# Altium schematic sheet PowerAssembly.SchDoc: Board Power Assembly
size 292 x 193 mm; CheckedBy: Jakub Howorus; Author: Łukasz Gójski; CompanyName: Politechnika Warszawska; DrawnBy: Łukasz Gójski; Organization: EITI; Address1: Nowowiejska 15/19; Address2: 00-665 Warszawa; SheetNumber: 2; SheetTotal: 13; HTTPLink: www.pw.edu.pl
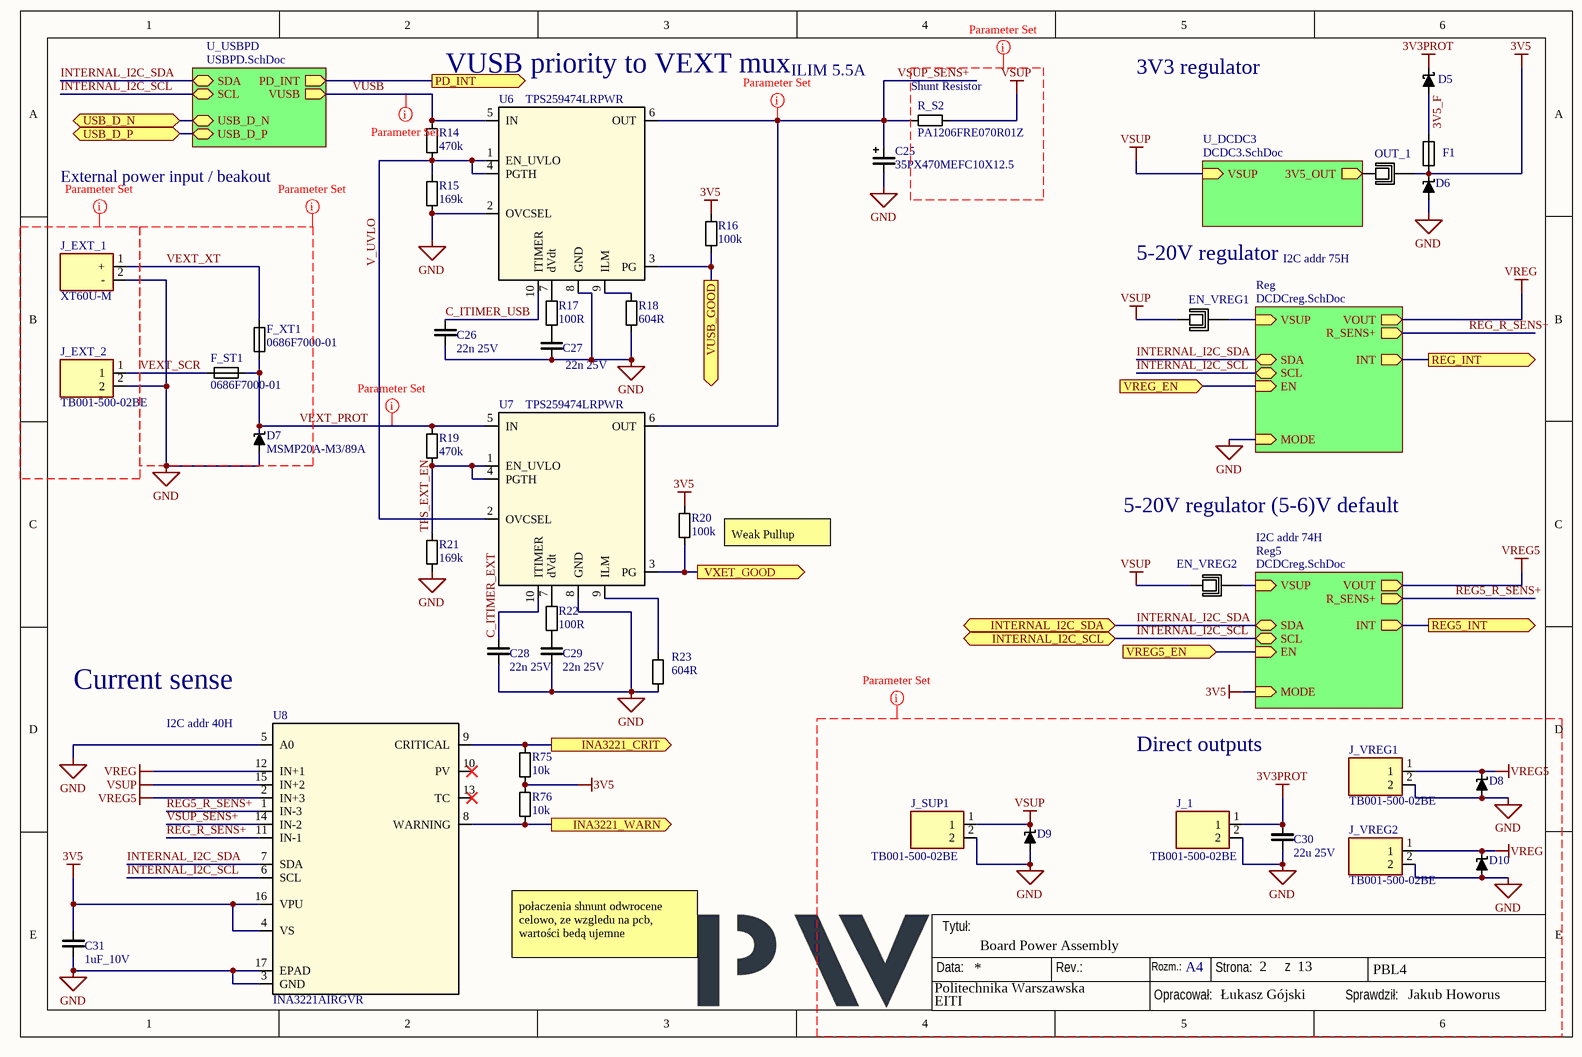
[diagram p0: PowerAssembly.SchDoc]

## Parts
C25  35PX470MEFC10X12.5  [CAP_PKPZ_10X12P5_LOW_RUB]
C26  22n 25V  [C_0603]
C27  22n 25V  [C_0603]
C28  22n 25V  [C_0603]
C29  22n 25V  [C_0603]
C30  22u 25V  [C_1206]
C31  1uF_10V  [C_0603]
D5  SL12-E3/61T  [DIONM5127X229N]  (value not drawn)
D6  MSMP20A-M3/89A  [CR_0A-M389A_VIS]  (value not drawn)
D7  MSMP20A-M3/89A  [CR_0A-M389A_VIS]
D8  MSMP20A-M3/89A  [CR_0A-M389A_VIS]  (value not drawn)
D9  MSMP20A-M3/89A  [CR_0A-M389A_VIS]  (value not drawn)
D10  MSMP20A-M3/89A  [CR_0A-M389A_VIS]  (value not drawn)
EN_VREG1  JUMPER  [Jumper]  (value not drawn)
EN_VREG2  JUMPER  [Jumper]  (value not drawn)
F1  SD110-08  [1812]  (value not drawn)
F_ST1  0686F7000-01  [0603_FUSE]
F_XT1  0686F7000-01  [0603_FUSE]
J_1  TB001-500-02BE  [TB00150002BE]
J_EXT_1  XT60U-M  [XT60U-M]
J_EXT_2  TB001-500-02BE  [TB00150002BE]
J_SUP1  TB001-500-02BE  [TB00150002BE]
J_VREG1  TB001-500-02BE  [TB00150002BE]
J_VREG2  TB001-500-02BE  [TB00150002BE]
OUT_1  JUMPER  [Jumper]  (value not drawn)
R14  470k  [R_0603]
R15  169k  [R_0603]
R16  100k  [R_0603]
R17  100R  [R_0603]
R18  604R  [R_0603]
R19  470k  [R_0603]
R20  100k  [R_0603]
R21  169k  [R_0603]
R22  100R  [R_0603]
R23  604R  [R_0603]
R75  10k  [R_0603]
R76  10k  [R_0603]
R_S2  PA1206FRE070R01Z  [R_1206]
U6  TPS259474LRPWR  [RPW0010A-MFG]
U7  TPS259474LRPWR  [RPW0010A-MFG]
U8  INA3221AIRGVR  [RGV16_2P16X2P16]

## Sub-sheets
Reg = DCDCreg.SchDoc: SDA (bidir), SCL (bidir), EN (in), VOUT (out), MODE (in), R_SENS+ (out), INT (out), VSUP (in)
Reg5 = DCDCreg.SchDoc: SDA (bidir), SCL (bidir), EN (in), VOUT (out), MODE (in), R_SENS+ (out), INT (out), VSUP (in)
U_DCDC3 = DCDC3.SchDoc: VSUP (in), 3V5_OUT (out)
U_USBPD = USBPD.SchDoc: PD_INT (out), SDA (bidir), SCL (bidir), VUSB (out), USB_D_N (bidir), USB_D_P (bidir)

## Ports
INA3221_CRIT (out, see MainAssembly[2A]), INA3221_WARN (out, see MainAssembly[2A]), INTERNAL_I2C_SCL (bidir, see MainAssembly[1A], MCU[6B]), INTERNAL_I2C_SDA (bidir, see MainAssembly[1A], MCU[6B]), PD_INT (out, see MainAssembly[2A], USBPD[4D]), REG5_INT (out, see MainAssembly[2A]), REG_INT (out, see MainAssembly[2A]), USB_D_N (bidir, see MainAssembly[2B], MCU[1A], USBPD[1D]), USB_D_P (bidir, see MainAssembly[2B], MCU[1B], USBPD[1D]), VREG5_EN (in, see MainAssembly[1A]), VREG_EN (in, see MainAssembly[1A]), VUSB_GOOD (out, see MainAssembly[2A]), VXET_GOOD (out, see MainAssembly[2A])

## Nets
3V3PROT: C30.2 D5.K J_1.1
3V5: C31.2 D6.K F1.2 OUT_1.2 R16.2 R20.2 R75.1 R76.2 U8.4(VS) U8.16(VPU) ; sheet Reg5/MODE
GND: C25.2 C26.1 C27.1 C28.1 C29.1 C30.1 C31.1 D6.A D7.A D8.A D9.A D10.A J_1.2 J_EXT_1.2(-) J_EXT_2.2 J_SUP1.2 J_VREG1.2 J_VREG2.2 R15.1 R18.1 R21.1 R23.1 U6.2(OVCSEL) U6.8(GND) U7.8(GND) U8.3(GND) U8.5(A0) U8.17(EPAD) ; sheet Reg/MODE
VREG: D10.K J_VREG2.1 U8.12(IN+1) ; sheet Reg/VOUT
VREG5: D8.K J_VREG1.1 U8.2(IN+3) ; sheet Reg5/VOUT
VSUP: D9.K EN_VREG1.1 EN_VREG2.1 J_SUP1.1 R_S2.2 U8.15(IN+2) ; sheet U_DCDC3/VSUP
3V5_F: D5.A F1.1
C_ITIMER_EXT: C28.2 U7.10(ITIMER)
C_ITIMER_USB: C26.2 U6.10(ITIMER)
INA3221_CRIT: R75.2 U8.9(CRITICAL) ; port INA3221_CRIT
INA3221_WARN: R76.1 U8.8(WARNING) ; port INA3221_WARN
INTERNAL_I2C_SCL: U8.6(SCL) ; port INTERNAL_I2C_SCL, sheet Reg/SCL, sheet U_USBPD/SCL, sheet Reg5/SCL
INTERNAL_I2C_SDA: U8.7(SDA) ; port INTERNAL_I2C_SDA, sheet Reg/SDA, sheet U_USBPD/SDA, sheet Reg5/SDA
PD_INT: port PD_INT, sheet U_USBPD/PD_INT
REG5_INT: port REG5_INT, sheet Reg5/INT
REG5_R_SENS+: U8.1(IN-3) ; sheet Reg5/R_SENS+
REG_INT: port REG_INT, sheet Reg/INT
REG_R_SENS+: U8.11(IN-1) ; sheet Reg/R_SENS+
TPS_EXT_EN: R19.1 R21.2 U7.1(EN_UVLO) U7.4(PGTH)
USB_D_N: port USB_D_N, sheet U_USBPD/USB_D_N
USB_D_P: port USB_D_P, sheet U_USBPD/USB_D_P
V_UVLO: R14.1 R15.2 U6.1(EN_UVLO) U6.4(PGTH) U7.2(OVCSEL)
VEXT_PROT: D7.K F_ST1.2 F_XT1.2 R19.2 U7.5(IN)
VEXT_SCR: F_ST1.1 J_EXT_2.1
VEXT_XT: F_XT1.1 J_EXT_1.1(+)
VREG5_EN: port VREG5_EN, sheet Reg5/EN
VREG_EN: port VREG_EN, sheet Reg/EN
VSUP_SENS+: C25.1 R_S2.1 U6.6(OUT) U7.6(OUT) U8.14(IN-2)
VUSB: R14.2 U6.5(IN) ; sheet U_USBPD/VUSB
VUSB_GOOD: R16.1 U6.3(PG) ; port VUSB_GOOD
VXET_GOOD: R20.1 U7.3(PG) ; port VXET_GOOD
NetC27_2: C27.2 R17.1
NetC29_2: C29.2 R22.1
NetEN_VREG1_2: EN_VREG1.2 ; sheet Reg/VSUP
NetEN_VREG2_2: EN_VREG2.2 ; sheet Reg5/VSUP
NetOUT_1_1: OUT_1.1 ; sheet U_DCDC3/3V5_OUT
NetR17_2: R17.2 U6.7(dVdt)
NetR18_2: R18.2 U6.9(ILM)
NetR22_2: R22.2 U7.7(dVdt)
NetR23_2: R23.2 U7.9(ILM)

Not connected (* = marked no-connect by the designer): U8 10(PV)* 13(TC)*

## Layout directives
CompClassName: NoRelief: GND, VEXT_PROT, VEXT_SCR, VEXT_XT, VSUP
CompClassName: NoRelief; net class NoRelief: VEXT_PROT, VSUP_SENS+, VUSB
CompClassName: ThickRelief: 3V3PROT, GND, VEXT_SCR, VREG, VREG5, VSUP

## Notes on the sheet
- VUSB priority to VEXT mux
- ILIM 5.5A
- (near R_S2) Shunt Resistor
- 3V3 regulator
- External power input / beakout
- (near EN_VREG1) 5-20V regulator
- I2C addr 75H
- 5-20V regulator (5-6)V default
- (near R20) Weak Pullup
- (near EN_VREG2) I2C addr 74H
- (near U8) Current sense
- (near U8) I2C addr 40H
- Direct outputs
- połaczenia shnunt odwrocene celowo, ze wzgledu na pcb, wartości bedą ujemne
- Data:
- Tytuł:
- Rev.:
- Rozm.:
- A4
- Strona:
- z
- PBL4
- Opracował:
- Sprawdził:

## Library data of the parts
C25 = C_Pol_470uF_35V: 470 µF 35 V Aluminum Electrolytic Capacitors Radial, Can 2000 Hrs @ 105°C; Manufacturer: Rubycon; Value: 470u; Voltage: 35V; Tolerance: 20%
C26-C29 = C_22nF_25V: Ceramic capacitor; Casing: 0603; Dielectric: X5R; Tolerance: 10%; Value: 22n; Voltage: 25V; Technology: Ceramic
C30 = C_22uF_25V: Ceramic capacitor; Casing: 1206; Dielectric: X7R; Tolerance: 20%; Value: 22u; Voltage: 25V; Technology: Ceramic
C31 = C_1uF_10V: Ceramic capacitor; Value: 1u; Voltage: 10V; Casing: 0603; Dielectric: X7R; Tolerance: 10%; Technology: Ceramic
D5 = D schottky 1.5A: Schottky Diode 1500mA 30V reverse; Casing: SMA (DO-214AC); Reverse standoff voltage: 20V; VFm: 380mV@1000mA
D6-D10 = TVS_22V: 22V Breakdown MSMP20A-M3/89A; ComponentLink1Description: Datasheet; ComponentLink1URL: https://www.bourns.com/docs/product-datasheets/smbj.pdf; ComponentLink2Description: Supplier; ComponentLink2URL: https://www.mouser.pl/ProductDetail/Bourns/SMBJ22A?qs=%252Bf8Cd6aE5bxYX21zv65pDQ%3D%3D; Value: 22V
EN_VREG1 EN_VREG2 OUT_1 = Jumper x2: Jumper on traces
F1 = PTC 1.1A FUSE: FUSE PTC 1.1A 8VDC 2.2A TRIP
F_ST1 F_XT1 = F_7A: 7A fuse 0603 package; Manufacturer: Bel fuse Inc.; Current: 7A
J_1 J_EXT_2 J_SUP1 J_VREG1 J_VREG2 = Screw Terminal x2 5mm: Screw terminal x2 5mm spacing; Manufacturer: Same Sky; MP: TB001-500-02BE
J_EXT_1 = XT60: XT60 male connector, ewentualnie dostępny w zasobach prywatnych (5szt); Manufacturer: AMASS
R14 R19 = R_470k: Resistor; Tolerance: 1%; Power: 100mW; Casing: 0603; Value: 470k
R15 R21 = R_169k: Resistor; Tolerance: 1%; Power: 100mW; Casing: 0603; Value: 169k
R16 R20 = R_100k: Resistor; Tolerance: 1%; Power: 100mW; Casing: 0603; Value: 100k
R17 R22 = R_100R: Resistor; Tolerance: 1%; Power: 100mW; Casing: 0603; Value: 100R
R18 R23 = R_604R: Resistor; Tolerance: 1%; Power: 100mW; Casing: 0603; Value: 604R
R75 R76 = R_10k: Resistor; Tolerance: 1%; Power: 100mW; Casing: 0603; Value: 10k
R_S2 = R_10mR: Shunt Resistor 10 mR, 1206, 250mW; Value: 10mR; Tolerance: 1%; Casing: 1206; Power: 250mW
U6 U7 = TPS259474LRPWR: 2.7-V to 23-V, 5.5-A eFuse with integrated reverse polarity protection 10-VQFN-HR; Manufacturer: Texas Instruments; Manufacturer_Part_Number: TPS259474LRPWR
U8 = INA3221AIRGVR: 26V, triple channel, 13-bit, i2c output current/voltage monitor w/alerts 16-VQFN; Manufacturer: Texas Instruments; Manufacturer_Part_Number: INA3221AIRGVR; Datasheet: https://www.ti.com/lit/gpn/ina3221